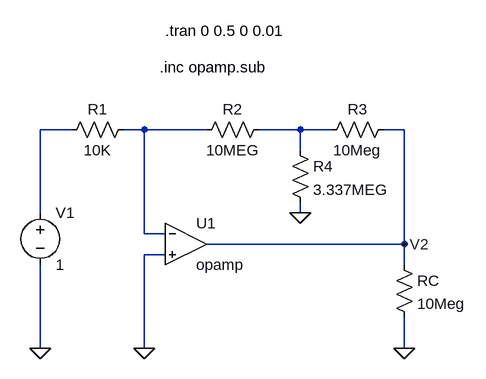
[diagram p0: schematic ej1_a.asc]
ej1_a.asc, the LTspice schematic file:
Version 4
SHEET 1 880 680
WIRE -48 80 -96 80
WIRE 64 80 32 80
WIRE 160 80 64 80
WIRE 304 80 240 80
WIRE 352 80 304 80
WIRE 464 80 432 80
WIRE 304 112 304 80
WIRE -96 208 -96 80
WIRE 304 208 304 192
WIRE 64 240 64 80
WIRE 96 240 64 240
WIRE 464 256 464 80
WIRE 464 256 160 256
WIRE 96 272 64 272
WIRE 464 288 464 256
WIRE -96 416 -96 288
WIRE 64 416 64 272
WIRE 464 416 464 368
FLAG 464 416 0
FLAG 64 416 0
FLAG -96 416 0
FLAG 464 256 V2
FLAG 304 208 0
SYMBOL res -64 96 R270
WINDOW 0 32 56 VTop 2
WINDOW 3 0 56 VBottom 2
SYMATTR InstName R1
SYMATTR Value 10K
SYMBOL res 144 96 R270
WINDOW 0 32 56 VTop 2
WINDOW 3 0 56 VBottom 2
SYMATTR InstName R2
SYMATTR Value 10MEG
SYMBOL res 336 96 R270
WINDOW 0 32 56 VTop 2
WINDOW 3 0 56 VBottom 2
SYMATTR InstName R3
SYMATTR Value 10Meg
SYMBOL res 288 96 R0
SYMATTR InstName R4
SYMATTR Value 3.337MEG
SYMBOL res 448 272 R0
SYMATTR InstName RC
SYMATTR Value 10Meg
SYMBOL voltage -96 192 R0
SYMATTR InstName V1
SYMATTR Value 1
SYMBOL Opamps\\opamp 128 192 R0
SYMATTR InstName U1
TEXT 88 -16 Left 2 !.inc opamp.sub
TEXT 96 -72 Left 2 !.tran 0 0.5 0 0.01

The netlist it stands for:
* ej1_a.asc
R1 N001 N002 10K
R2 N002 N003 10MEG
R3 N003 V2 10Meg
R4 N003 0 3.337MEG
RC V2 0 10Meg
V1 N001 0 1
XU1 N002 0 V2 opamp Aol=100K GBW=10Meg  ; pins invin noninvin out
.inc opamp.sub
.tran 0 0.5 0 0.01
.backanno
.end